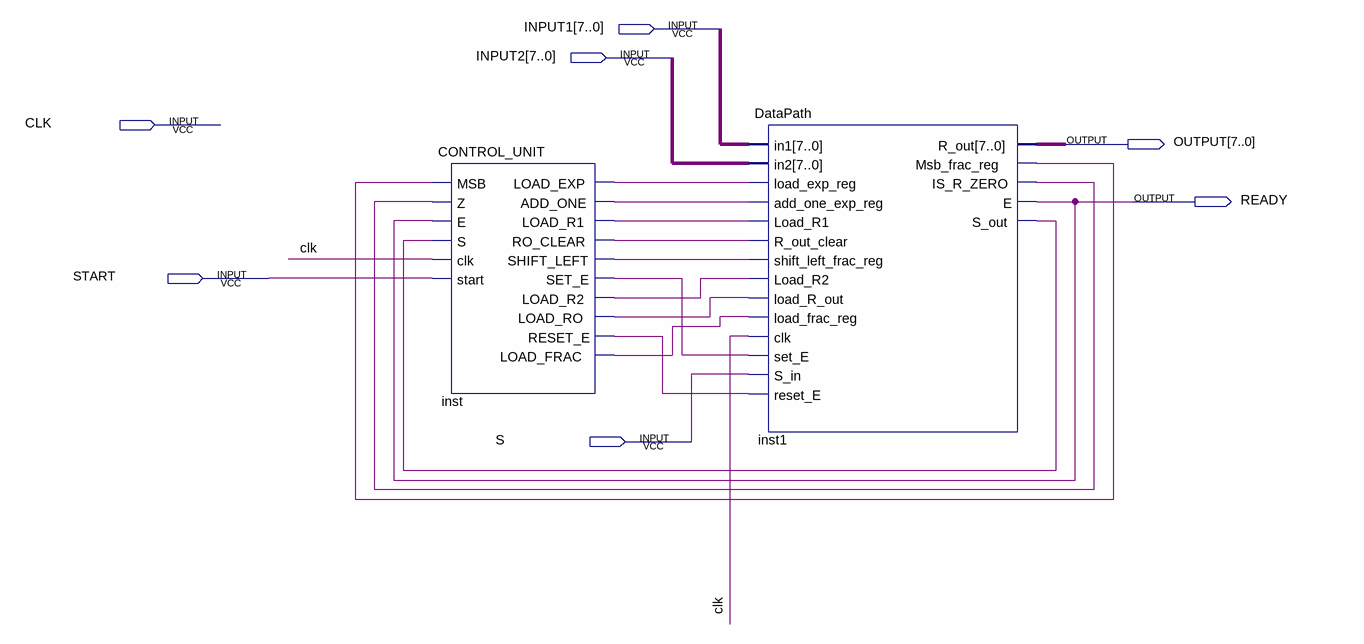
[diagram p0: schematic sheet]
// Quartus schematic FinalCircuit.bdf as structural Verilog: 2 symbols, 7 pins
module FinalCircuit (
  input  [7:0] INPUT1,
  input  [7:0] INPUT2,
  input  CLK,
  input  START,
  input  S,
  output [7:0] OUTPUT,
  output READY
);

  wire inst1_is_r_zero, inst1_msb_frac_reg, inst1_s_out, inst_add_one, inst_load_exp, inst_load_frac,
       inst_load_r1, inst_load_r2, inst_load_ro, inst_reset_e, inst_ro_clear, inst_set_e, inst_shift_left;

  CONTROL_UNIT inst (
    .MSB(inst1_msb_frac_reg), .Z(inst1_is_r_zero), .E(READY), .S(inst1_s_out), .clk(CLK), .start(START),
    .LOAD_EXP(inst_load_exp), .ADD_ONE(inst_add_one), .LOAD_R1(inst_load_r1), .RO_CLEAR(inst_ro_clear),
    .SHIFT_LEFT(inst_shift_left), .SET_E(inst_set_e), .LOAD_R2(inst_load_r2), .LOAD_RO(inst_load_ro),
    .RESET_E(inst_reset_e), .LOAD_FRAC(inst_load_frac));
  DataPath inst1 (
    .in1(INPUT1), .in2(INPUT2), .load_exp_reg(inst_load_exp), .add_one_exp_reg(inst_add_one),
    .Load_R1(inst_load_r1), .R_out_clear(inst_ro_clear), .shift_left_frac_reg(inst_shift_left),
    .Load_R2(inst_load_r2), .load_R_out(inst_load_ro), .load_frac_reg(inst_load_frac), .clk(CLK),
    .set_E(inst_set_e), .S_in(S), .reset_E(inst_reset_e), .R_out(OUTPUT), .Msb_frac_reg(inst1_msb_frac_reg),
    .IS_R_ZERO(inst1_is_r_zero), .E(READY), .S_out(inst1_s_out));
endmodule
